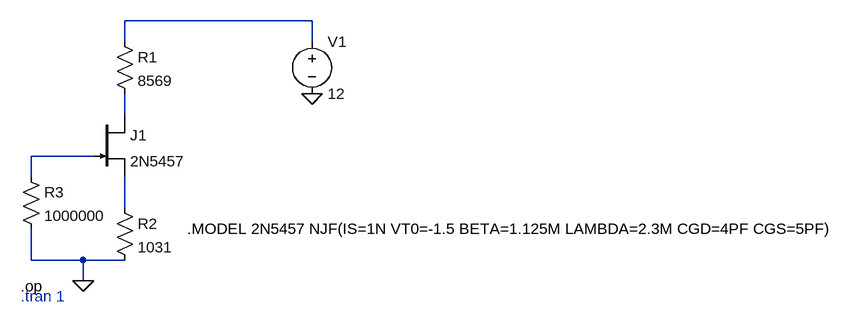
[diagram p0: schematic Simulacion no normalizada.asc]
Simulacion no normalizada.asc, the LTspice schematic file:
Version 4.1
SHEET 1 1216 680
WIRE 368 -144 80 -144
WIRE 80 -112 80 -144
WIRE 368 -112 368 -144
WIRE 80 0 80 -32
WIRE 32 64 -64 64
WIRE -64 96 -64 64
WIRE 80 144 80 96
WIRE -64 224 -64 176
WIRE 16 224 -64 224
WIRE 80 224 16 224
WIRE 16 256 16 224
FLAG 368 -32 0
FLAG 16 256 0
DATAFLAG 80 -16 "$-V(N004)"
SYMBOL njf 32 0 R0
SYMATTR InstName J1
SYMATTR Value 2N5457
SYMBOL res 64 -128 R0
SYMATTR InstName R1
SYMATTR Value 8569
SYMBOL res 64 128 R0
SYMATTR InstName R2
SYMATTR Value 1031
SYMBOL res -80 80 R0
SYMATTR InstName R3
SYMATTR Value 1000000
SYMBOL voltage 368 -128 R0
WINDOW 123 0 0 Left 0
WINDOW 39 0 0 Left 0
SYMATTR InstName V1
SYMATTR Value 12
TEXT 176 176 Left 2 !.MODEL 2N5457 NJF(IS=1N VT0=-1.5 BETA=1.125M LAMBDA=2.3M CGD=4PF CGS=5PF)
TEXT -80 280 Left 2 ;.tran 1
TEXT -80 264 Left 2 !.op

The netlist it stands for:
* Simulacion no normalizada.asc
J1 N002 N003 N004 2N5457
R1 N001 N002 8569
R2 N004 0 1031
R3 N003 0 1000000
V1 N001 0 12
.model NJF NJF
.model PJF PJF
.lib standard.jft
.MODEL 2N5457 NJF(IS=1N VT0=-1.5 BETA=1.125M LAMBDA=2.3M CGD=4PF CGS=5PF)
* .tran 1
.op
.backanno
.end